# Altium schematic sheet Sheet1.SchDoc
size A4
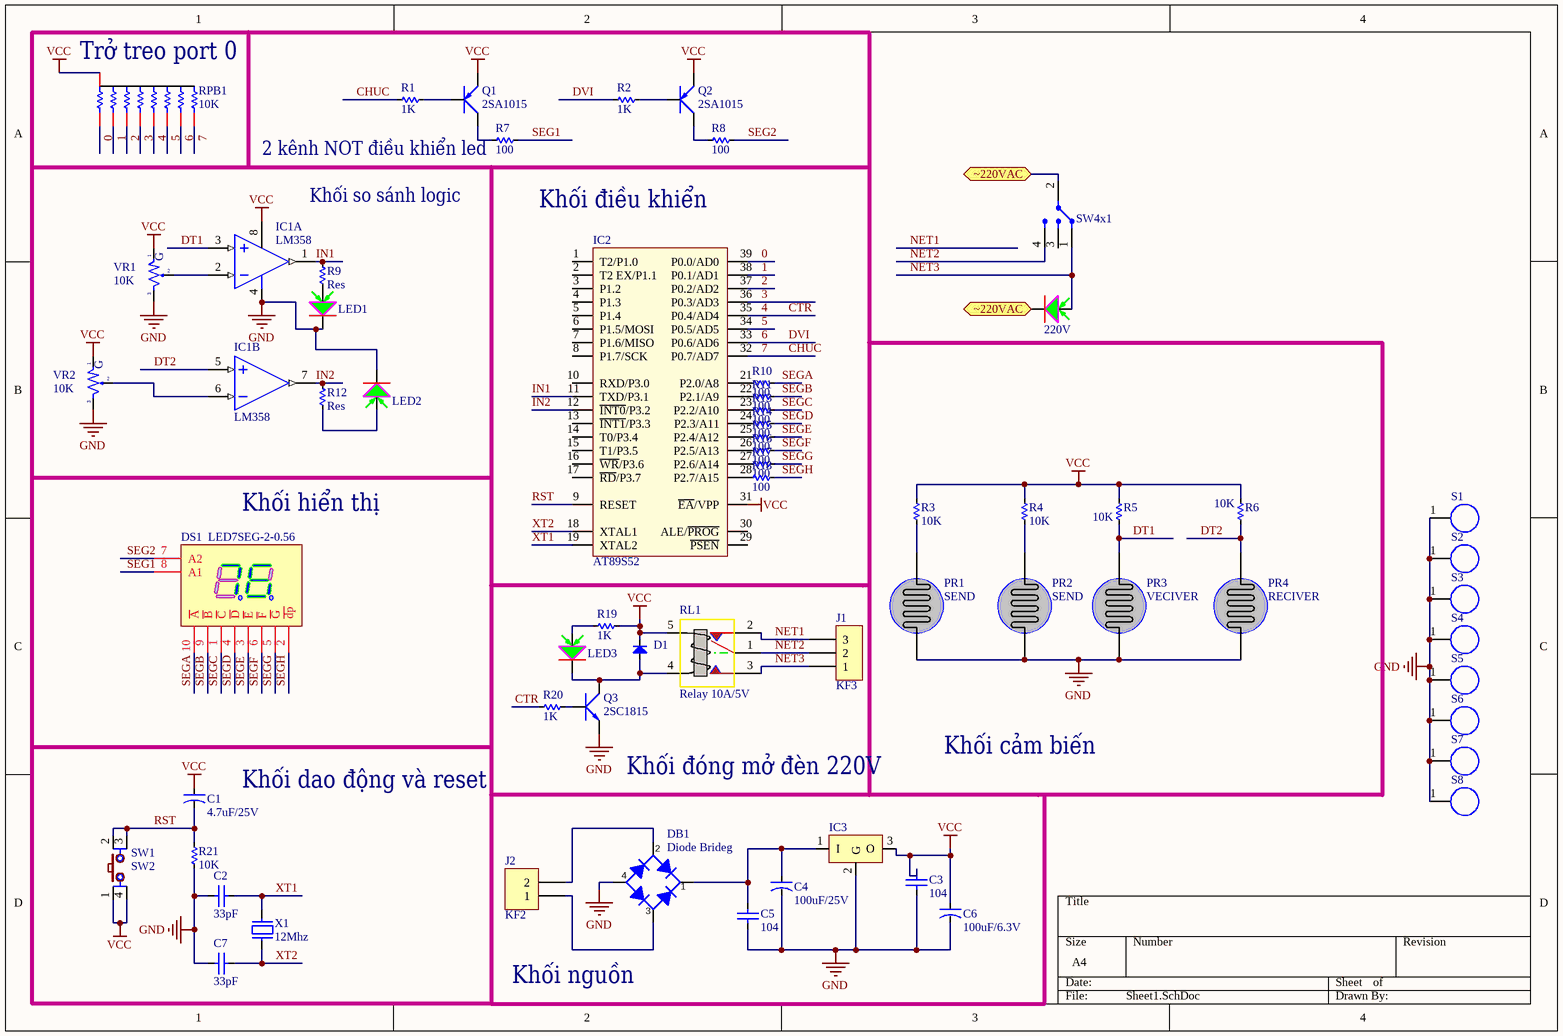
[diagram p0: Sheet1.SchDoc]

## Parts
220V  LED  [LED-5-Green]  (value not drawn)
C1  4.7uF/25V  [CA-ALU-5W]
C2  33pF  [CN1]
C3  104  [CN1.5]
C4  100uF/25V  [CA-ALU-10GR]
C5  104  [CN1.5]
C6  100uF/6.3V  [CA-ALU-10GR]
C7  33pF  [CN1]
D1  Diode  [DIO-2A]  (value not drawn)
DB1  Diode Brideg  [DIO-Bri 2A]
DS1  LED7SEG-2-0.56  [LED7SEG-2-0.56]
IC1  LM358  [DIP8]  (parts A,B of 2)
IC2  AT89S52  [DIP40/W0.6]
IC3  LM78xx  [TO220H1]  (value not drawn)
J1  KF3  [KF3-5.08]
J2  KF2  [KF2-5.08]
LED1  LED  [LED-3MM-GREEN]  (value not drawn)
LED2  LED  [LED-3MM-GREEN]  (value not drawn)
LED3  LED  [LED-3MM-YELLOW]  (value not drawn)
PR1  SEND  [LED-5-WHITE]
PR2  SEND  [LED-5-WHITE]
PR3  VECIVER  [LED-5-WHITE]
PR4  RECIVER  [LED-5-WHITE]
Q1  2SA1015  [TO92-123]
Q2  2SA1015  [TO92-123]
Q3  2SC1815  [TO92-123]
R1  1K  [RES-1/4W-SMALL]
R2  1K  [RES-1/4W-SMALL]
R3  10K  [RES-1/4W-SMALL]
R4  10K  [RES-1/4W-SMALL]
R5  10K  [RES-1/4W-SMALL]
R6  10K  [RES-1/4W-SMALL]
R7  100  [RES-1/4WD]
R8  100  [RES-1/4WD]
R9  Res  [RES-1/4WD]
R10  100  [RES-1/4WD]
R11  100  [RES-1/4WD]
R12  Res  [RES-1/4WD]
R13  100  [RES-1/4WD]
R14  100  [RES-1/4WD]
R15  100  [RES-1/4WD]
R16  100  [RES-1/4WD]
R17  100  [RES-1/4WD]
R18  100  [RES-1/4WD]
R19  1K  [RES-1/4W-SMALL]
R20  1K  [RES-1/4WD]
R21  10K  [RES-1/4W-SMALL]
RL1  Relay 10A/5V  [RELAY1]
RPB1  10K  [RN8]
S1  (no value)  [VDI]
S2  (no value)  [VDI]
S3  (no value)  [VDI]
S4  (no value)  [VDI]
S5  (no value)  [VDI]
S6  (no value)  [VDI]
S7  (no value)  [VDI]
S8  (no value)  [VDI]
SW1  SW2  [SW2-DIP]
SW?  SW4x1  [SW3-DIP]
VR1  10K  [VR-S3]
VR2  10K  [VR-S3]
X1  12Mhz  [XT2]

## Ports
~220VAC

## Nets
GND: C2.1 C3.2 C4.2 C5.2 C6.2 C7.1 DB1.4(A) IC1.4(-V) IC2.20(GND) IC3.2(G) LED1.2(K) LED2.2(K) PR1.2 PR2.2 PR3.2 PR4.2 Q3.1(E) R21.2 S1.1 S2.1 S3.1 S4.1 S5.1 S6.1 S7.1 S8.1 VR1.3 VR2.3
VCC: C1.1 C3.1 C6.1 D1.2(K) IC1.8(+V) IC2.31(~{EA}/VPP) IC2.40(VCC) IC3.3(O) Q1.1(E) Q2.1(E) R3.1 R4.1 R5.1 R6.1 R19.1 RL1.5 RPB1.1 SW1.1 SW1.4 VR1.1 VR2.1
0: IC2.39(P0.0/AD0) RPB1.2
1: IC2.38(P0.1/AD1) RPB1.3
2: IC2.37(P0.2/AD2) RPB1.4
3: IC2.36(P0.3/AD3) RPB1.5
4: IC2.35(P0.4/AD4) R20.2 RPB1.6  [also labelled CTR]
5: IC2.34(P0.5/AD5) RPB1.7
6: IC2.33(P0.6/AD6) R2.2 RPB1.8  [also labelled DVI]
7: IC2.32(P0.7/AD7) R1.2 RPB1.9  [also labelled CHUC]
DT1: IC1.3(IN+) PR3.1 R5.2
DT2: IC1.5(IN+) PR4.1 R6.2
IN1: IC1.1(OUT) IC2.11(TXD/P3.1) R9.1
IN2: IC1.7(OUT) IC2.12(~{INT0}/P3.2) R12.1
NET1: J1.3 RL1.2
NET2: J1.2 RL1.1 SW?.4
NET3: 220V.1(A) J1.1 RL1.3 SW?.1
RST: C1.2 IC2.9(RESET) R21.1 SW1.2 SW1.3
SEG1: DS1.8(A1) R7.1
SEG2: DS1.7(A2) R8.1
SEGA: DS1.10(~{A}) R10.1
SEGB: DS1.9(~{B}) R11.1
SEGC: DS1.1(~{C}) R13.1
SEGD: DS1.4(~{D}) R14.1
SEGE: DS1.3(~{E}) R15.1
SEGF: DS1.6(~{F}) R16.1
SEGG: DS1.5(~{G}) R17.1
SEGH: DS1.2(~{dp}) R18.1
XT1: C2.2 IC2.19(XTAL2) X1.2
XT2: C7.2 IC2.18(XTAL1) X1.1
~220VAC: 220V.2(K) SW?.2 ; port ~220VAC
NetC4_1: C4.1 C5.1 DB1.1(K) IC3.1(I)
NetD1_1: D1.1(A) LED3.2(K) Q3.2(C) RL1.4
NetDB1_2: DB1.2(C) J2.2
NetDB1_3: DB1.3(C) J2.1
NetIC1_2: IC1.2(IN-) VR1.2
NetIC1_6: IC1.6(IN-) VR2.2
NetIC2_21: IC2.21(P2.0/A8) R10.2
NetIC2_22: IC2.22(P2.1/A9) R11.2
NetIC2_23: IC2.23(P2.2/A10) R13.2
NetIC2_24: IC2.24(P2.3/A11) R14.2
NetIC2_25: IC2.25(P2.4/A12) R15.2
NetIC2_26: IC2.26(P2.5/A13) R16.2
NetIC2_27: IC2.27(P2.6/A14) R17.2
NetIC2_28: IC2.28(P2.7/A15) R18.2
NetLED1_1: LED1.1(A) R9.2
NetLED2_1: LED2.1(A) R12.2
NetLED3_1: LED3.1(A) R19.2
NetPR1_1: PR1.1 R3.2
NetPR2_1: PR2.1 R4.2
NetQ1_2: Q1.2(C) R7.2
NetQ1_3: Q1.3(B) R1.1
NetQ2_2: Q2.2(C) R8.2
NetQ2_3: Q2.3(B) R2.1
NetQ3_3: Q3.3(B) R20.1

Not connected (* = marked no-connect by the designer): IC2 1(T2/P1.0) 2(T2_EX/P1.1) 3(P1.2) 4(P1.3) 5(P1.4) 6(P1.5/MOSI) 7(P1.6/MISO) 8(P1.7/SCK) 10(RXD/P3.0) 13(~{INT1}/P3.3) 14(T0/P3.4) 15(T1/P3.5) 16(~{WR}/P3.6) 17(~{RD}/P3.7) 29(~{PSEN}) 30(ALE/~{PROG}); SW? 3(I/O2)

## Notes on the sheet
- (near RPB1) Trở treo port 0
- (near R7) 2 kênh NOT điều khiển led
- Khối so sánh logic
- Khối điều khiển
- (near DS1) Khối hiển thị
- Khối dao động và reset
- Khối đóng mở đèn 220V
- Khối cảm biến
- Khối nguồn
- (in symbol VR-S) G

## Library data of the parts
220V LED1-LED3 = LED: LED Single colour Green and Red; Value: LED 3 ly Single Colour
C1 C4 C6 = CN-ALU-DIP: Capacitor (Semiconductor SIM Model); Value: 104; LatestRevisionDate: 17-Jul-2002; LatestRevisionNote: Re-released for DXP Platform.; PackageReference: C1206; Publisher: Altium Limited
C2 C7 = CN: Value: 33pF
C3 C5 = CN: Value: 33pF
D1 = Diode: Default Diode; Code - JEDEC: DO-214-AB; Value: 1N5007; Published: 8-Jun-2000; Revision: July-2002: Re-released for DXP Platform.; Publisher: Altium Limited
DB1 = DIODE BRI TYPE A: Convert AC to DC voltage, 4 pin; Value: Cau 1A
IC1 = LM358: Low-Power Dual Operational Amplifier; Value: LM358
IC2 = AT89S52: AT89S52, 8k Byte Flash Memory , 40 Pin; Value: AT89S52
IC3 = LM78xx: Positive Voltage Regulator; Note: Tab is connected to pin 3 (GND).; Published: 24-Aug-2001; LatestRevisionDate: 17-Jul-2002; LatestRevisionNote: Re-released for DXP Platform.; DatasheetVersion: Apr-1994; PackageVersion: Jul-1998; PackageReference: ISOWATT220AB; Publisher: Altium Limited; PackageDescription: TO, Thru-Hole, Vertical, Heatsink Mounted; 3 In-Line Leads; Pitch 2.54 mm; Pin sequence 1, 3, 2; ComponentLink1Description: Manufacturer Link; ComponentLink1URL: http://www.st.com/; ComponentLink2Description: Datasheet; ComponentLink2URL: http://www.st.com/stonline/products/literature/ds/2146/l78m05c.pdf
J1 = KF3: Manufacturer: Würth Elektronik eiSos GmbH; partNo: 691103110003; ComponentLink1 Description: Manufacturer; ComponentLink2 Description: Datasheet; NoPins: 3; Created Date: 29 October 2013; ComponentLink1URL: http://www.we-online.com; ComponentLink2URL: http://katalog.we-online.de/em/datasheet/6911031100xx.pdf; Created by: Karrer Zheng
J2 = KF2: Manufacturer: Würth Elektronik eiSos GmbH; partNo: 691103110002; ComponentLink1 Description: Manufacturer; ComponentLink2 Description: Datasheet; NoPins: 2; Created Date: 29 October 2013; ComponentLink1URL: http://www.we-online.com; ComponentLink2URL: http://katalog.we-online.de/em/datasheet/6911031100xx.pdf; Created by: Karrer Zheng
PR1-PR4 = CDS1: Photoresistor; Creator: Bien Nguyen
Q1 Q2 = 2SA1015: PNP 600mW, ECB; Value: A1015
Q3 = 2SC1815: NPN 600mW, ECB; Value: C1815
R1-R21 = Res: Manufacturer: Generic Components; Class: Passive; SubClass: R; Published: 08/06/2000; Publisher: Altium Hobart Technology Centre
RL1 = Relay1: Relay SPDT,10A - 12VDC 5 Pin; Value: Relay SPDT, 10A, 12V
RPB1 = RN8: Resistor 8 (Thanh); Value: Tro thanh 10K
S1-S8 = VDI: WA-SMSE SMD Steel Spacer with external Thread; partNo: 9771110360; Manufacturer: Wurth Elektronik; ComponentLink1Description: Manufacturer; ComponentLink1URL: http://www.we-online.de; Created by: Baojun Chen; Created Date: 19.Oct.2015; ComponentLink2Description: Datasheet; ComponentLink2URL: http://katalog.we-online.de/em/datasheet/9771110360.pdf
SW1 = SW2: Switch button 4 pin; Value: Button chip 4 pin
SW? = SW4x1: Value: Switch 4x2
VR1 VR2 = VR-S: Var Resistor; Value: Volume 50k
X1 = XT2: Crystal, 32.768 KHz, -40 to 85 degC, 3.2 x 1.5 x 0.9 mm SMD; Value: 4Mhz